# Altium schematic sheet schematics_Lampda_2024-07-19.schdoc
size 425 x 621 mm
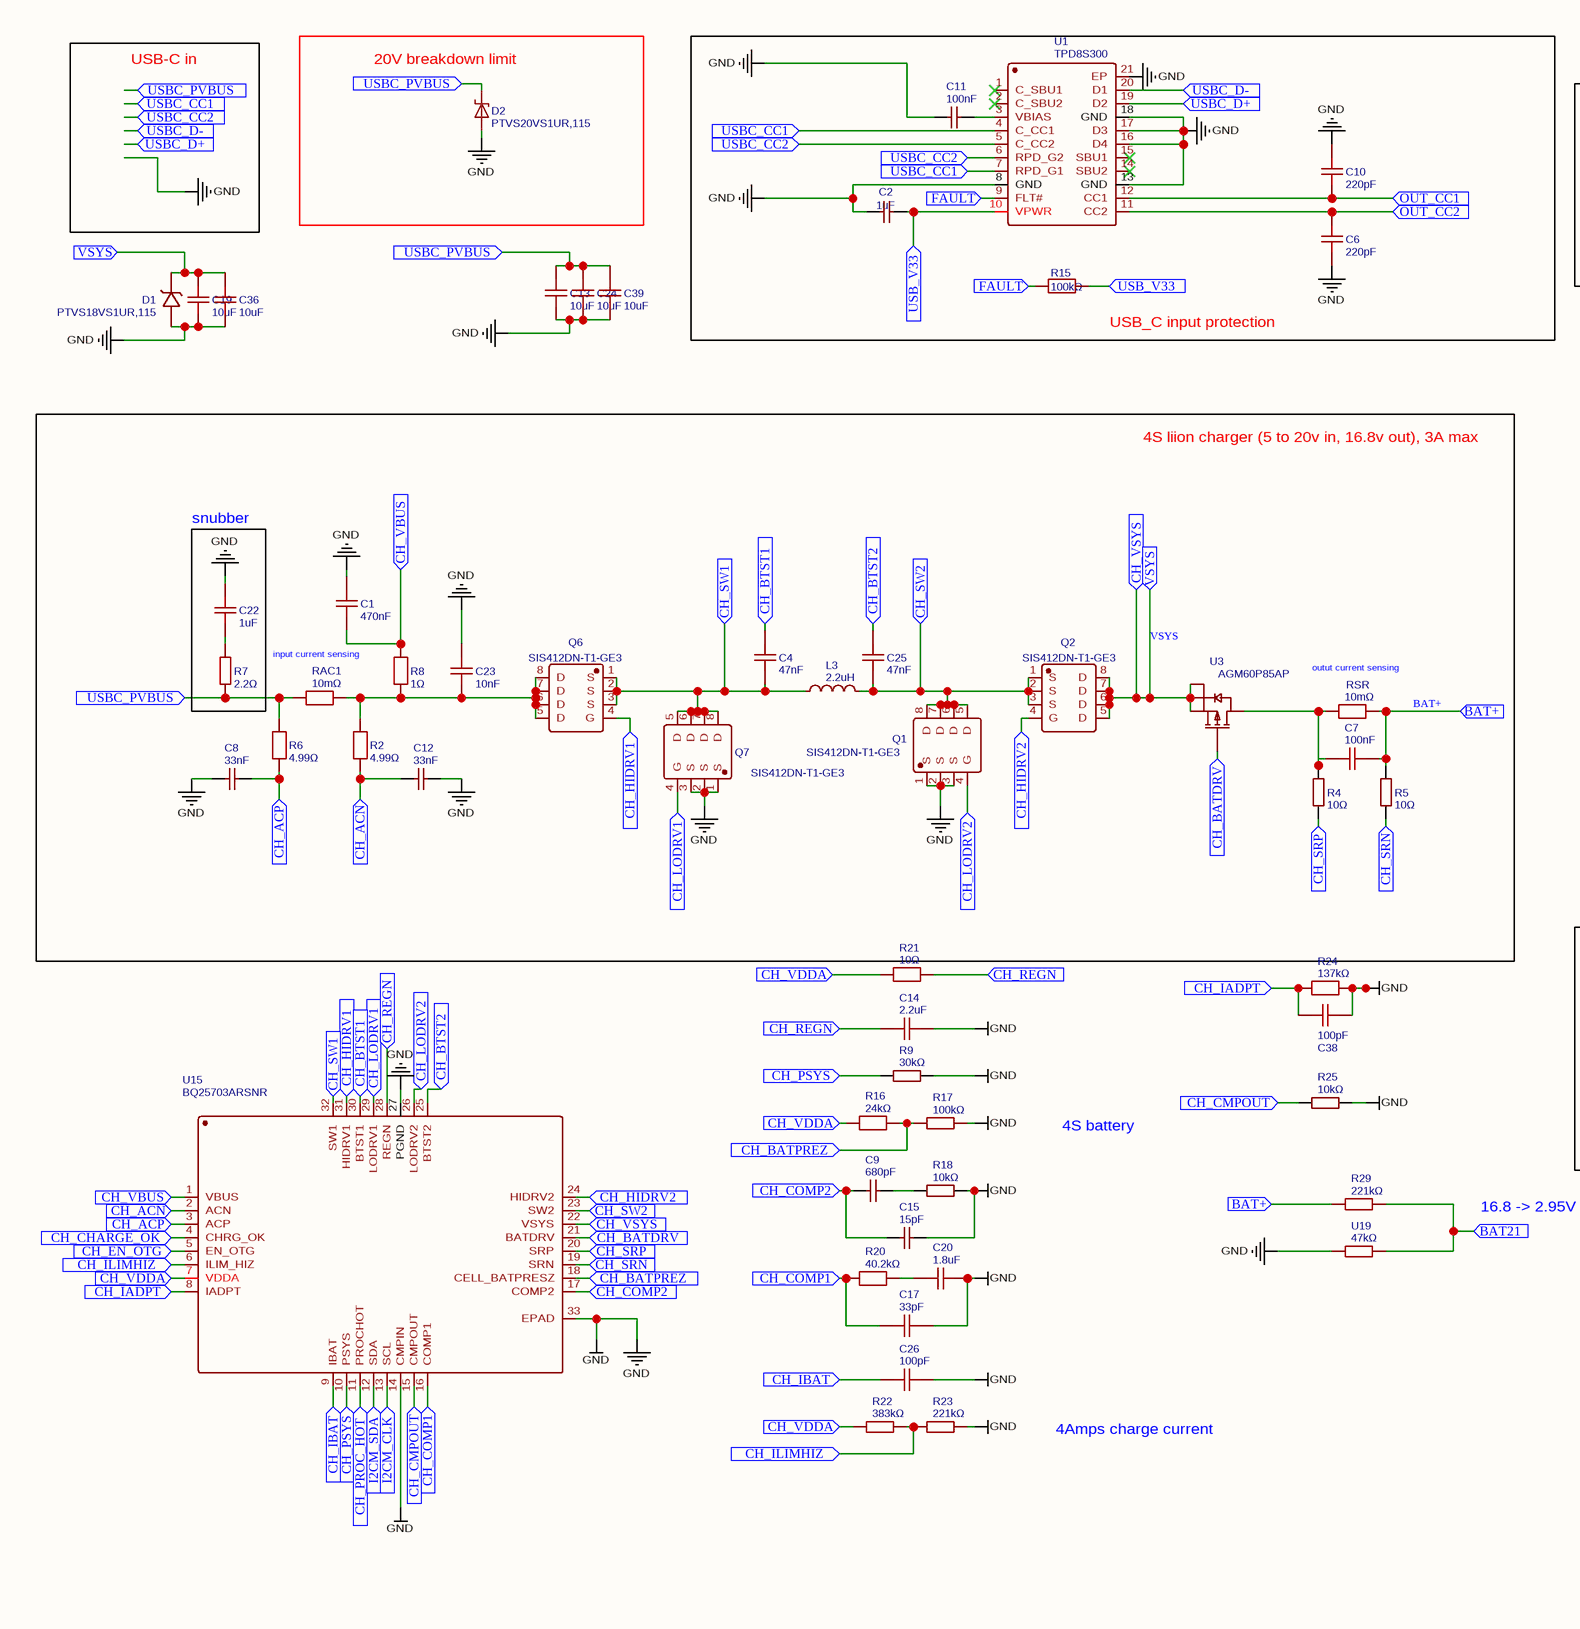
[diagram p0: schematics_Lampda_2024-07-19.schdoc, top left]
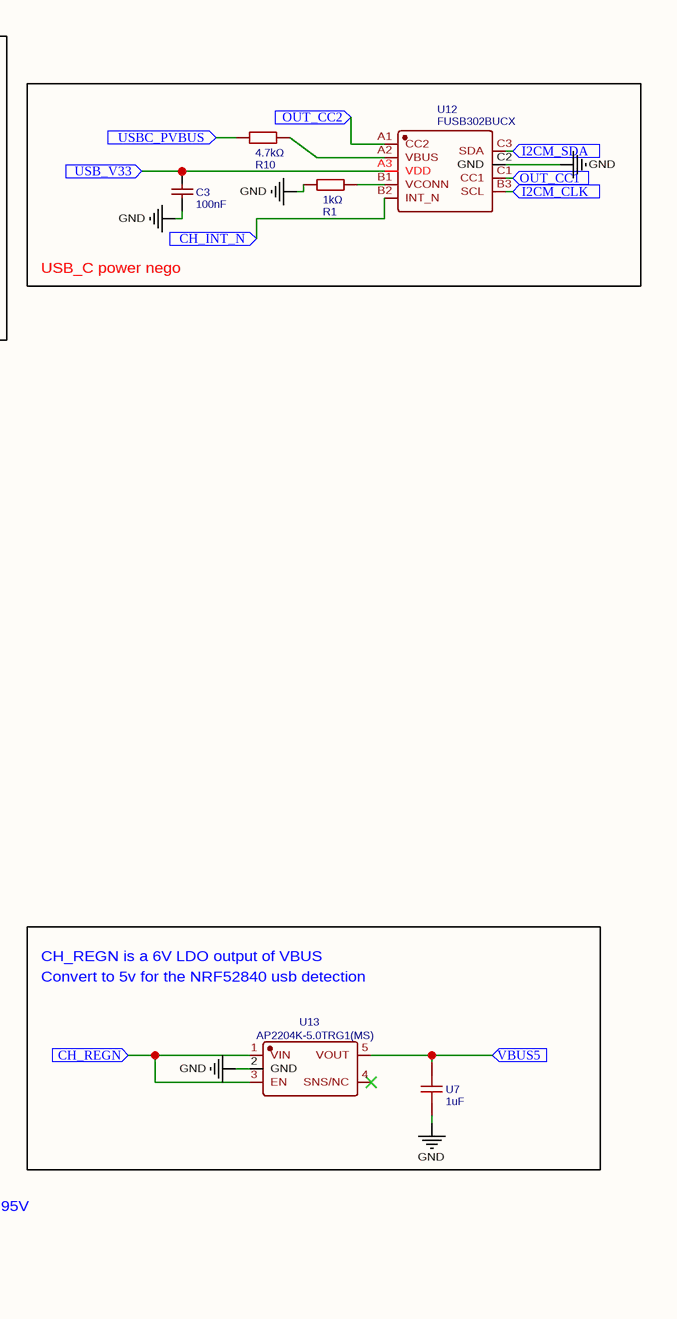
[diagram p1: schematics_Lampda_2024-07-19.schdoc, top right]
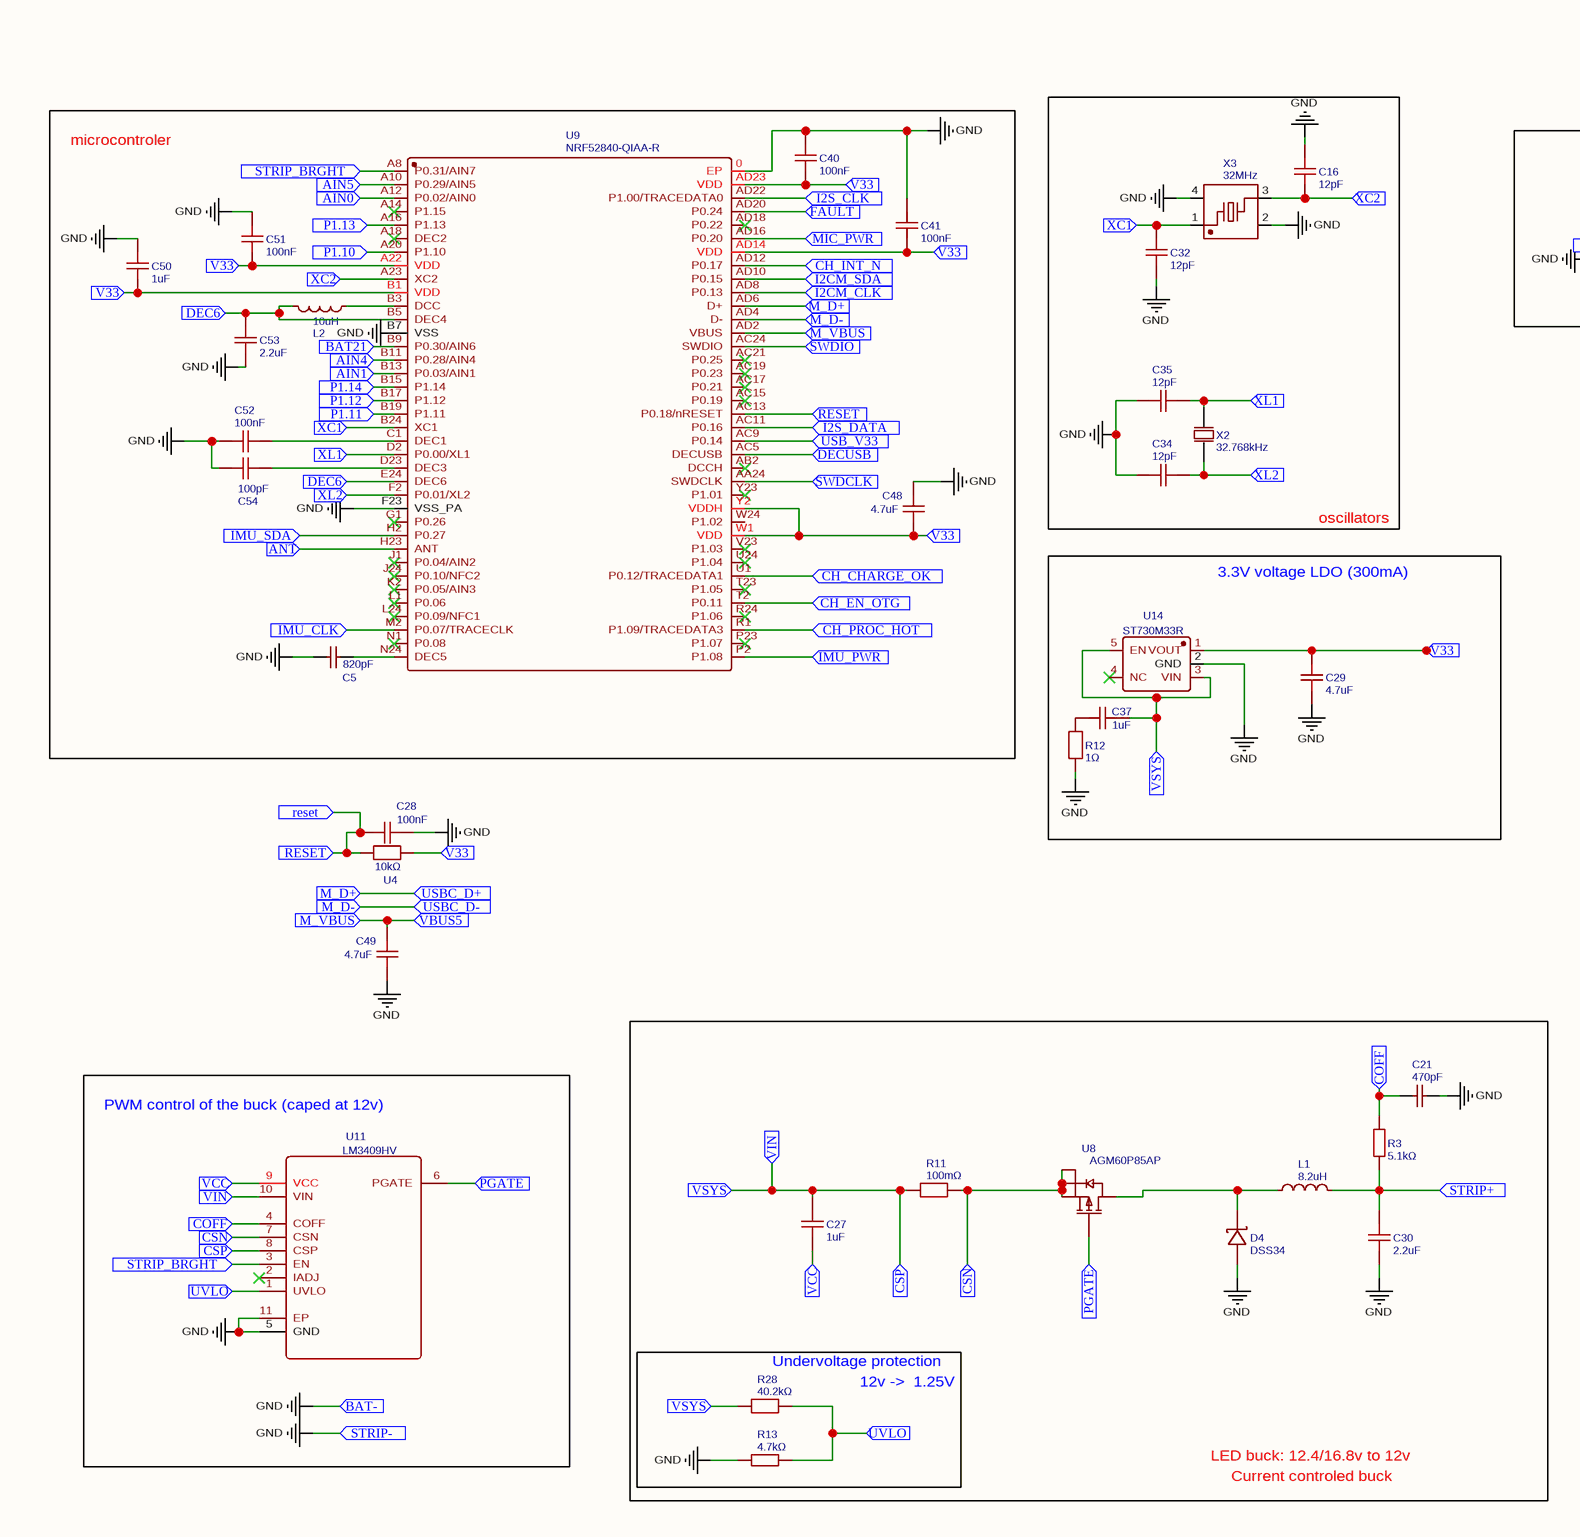
[diagram p2: schematics_Lampda_2024-07-19.schdoc, bottom left]
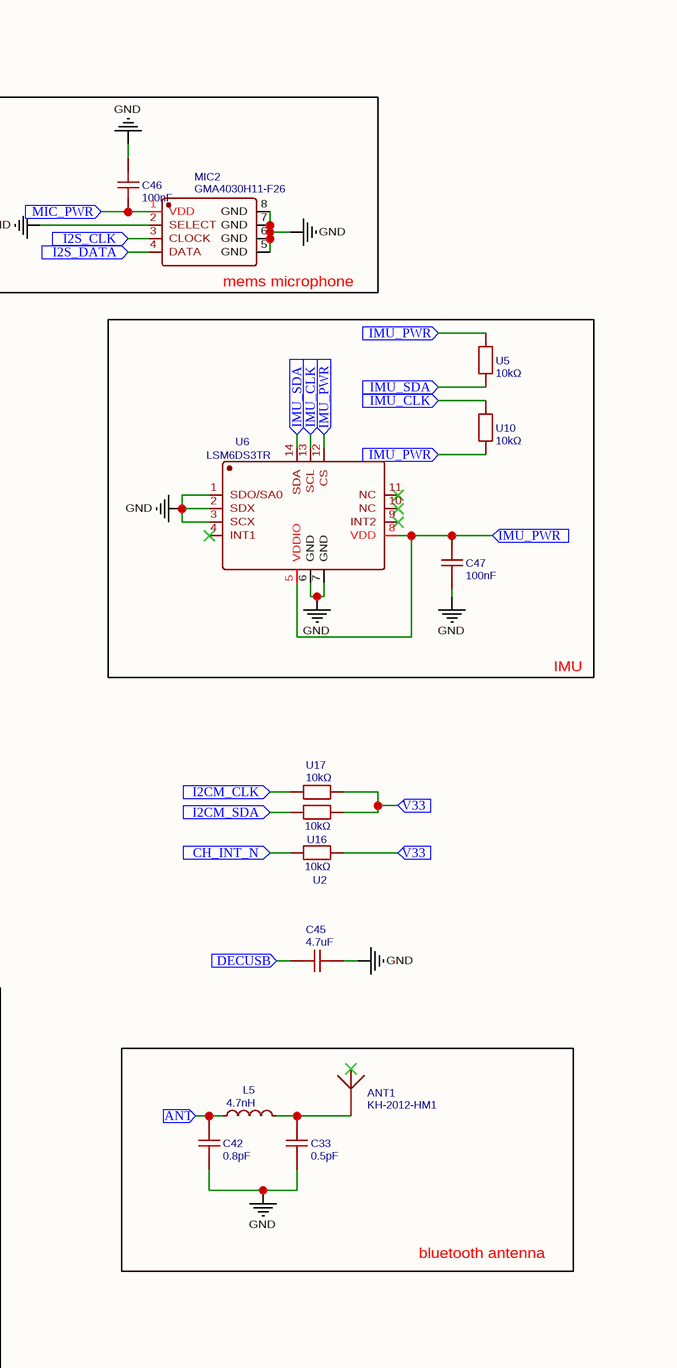
[diagram p3: schematics_Lampda_2024-07-19.schdoc, bottom right]

## Parts
ANT1  KH-2012-HM1  [ANT-SMD_2P-L2.0-W1.2]
C1  470nF  [C0402]
C2  1uF  [C0402]
C3  100nF  [C0402]
C4  47nF  [C0402]
C5  820pF  [C0402]
C6  220pF  [C0402]
C7  100nF  [C0402]
C8  33nF  [C0402]
C9  680pF  [C0402]
C10  220pF  [C0402]
C11  100nF  [C0402]
C12  33nF  [C0402]
C13  10uF  [C0805]
C14  2.2uF  [C0402]
C15  15pF  [C0402]
C16  12pF  [C0402]
C17  33pF  [C0402]
C19  10uF  [C0805]
C20  1.8uF  [C0603]
C21  470pF  [C0402]
C22  1uF  [C0402]
C23  10nF  [C0402]
C24  10uF  [C0805]
C25  47nF  [C0402]
C26  100pF  [C0402]
C27  1uF  [C0402]
C28  100nF  [C0402]
C29  4.7uF  [C0402]
C30  2.2uF  [C0805]
C32  12pF  [C0402]
C33  0.5pF  [C0402]
C34  12pF  [C0402]
C35  12pF  [C0402]
C36  10uF  [C0805]
C37  1uF  [C0402]
C38  100pF  [C0402]
C39  10uF  [C0805]
C40  100nF  [C0402]
C41  100nF  [C0402]
C42  0.8pF  [C0402]
C45  4.7uF  [C0402]
C46  100nF  [C0402]
C47  100nF  [C0402]
C48  4.7uF  [C0402]
C49  4.7uF  [C0402]
C50  1uF  [C0402]
C51  100nF  [C0402]
C52  100nF  [C0402]
C53  2.2uF  [C0402]
C54  100pF  [C0402]
D1  PTVS18VS1UR,115  [SOD-123_L2.6-W1.7-LS3.5-RD]
D2  PTVS20VS1UR,115  [SOD-123_L2.6-W1.7-LS3.5-RD]
D4  DSS34  [SOD-123_L2.8-W1.8-LS3.7-RD]
L1  8.2uH  [IND-SMD_L4.0-W4.0]
L2  10uH  [L0805]
L3  2.2uH  [IND-SMD_L4.8-W4.5]
L5  4.7nH  [L0402]
MIC2  GMA4030H11-F26  [MIC-SMD_8P-L3.0-W4.0-P0.85-BL]
Q1  SIS412DN-T1-GE3  [POWERPAK-1212-8_L3.0-W3.0-P0.65-LS3.3-BL]
Q2  SIS412DN-T1-GE3  [POWERPAK-1212-8_L3.0-W3.0-P0.65-LS3.3-BL]
Q6  SIS412DN-T1-GE3  [POWERPAK-1212-8_L3.0-W3.0-P0.65-LS3.3-BL]
Q7  SIS412DN-T1-GE3  [POWERPAK-1212-8_L3.0-W3.0-P0.65-LS3.3-BL]
R1  1kΩ  [R0402]
R2  4.99Ω  [R0402]
R3  5.1kΩ  [R0402]
R4  10Ω  [R0402]
R5  10Ω  [R0402]
R6  4.99Ω  [R0402]
R7  2.2Ω  [R0805]
R8  1Ω  [R0402]
R9  30kΩ  [R0402]
R10  4.7kΩ  [R0402]
R11  100mΩ  [R1206]
R12  1Ω  [R0402]
R13  4.7kΩ  [R0402]
R15  100kΩ  [R0402]
R16  24kΩ  [R0402]
R17  100kΩ  [R0402]
R18  10kΩ  [R0402]
R20  40.2kΩ  [R0402]
R21  10Ω  [R0402]
R22  383kΩ  [R0402]
R23  221kΩ  [R0402]
R24  137kΩ  [R0402]
R25  10kΩ  [R0402]
R28  40.2kΩ  [R0402]
R29  221kΩ  [R0402]
RAC1  10mΩ  [R1206]
RSR  10mΩ  [R1206]
U1  TPD8S300  [WQFN-20_L3.0-W3.0-P0.40-TL-EP]
U2  10kΩ  [R0402]
U3  AGM60P85AP  [WDFN-5_L3.3-W3.3-P0.65-BL]
U4  10kΩ  [R0402]
U5  10kΩ  [R0402]
U6  LSM6DS3TR  [LGA-14_L3.0-W2.5-P0.50-TL]
U7  1uF  [C0402]
U8  AGM60P85AP  [WDFN-5_L3.3-W3.3-P0.65-BL]
U9  NRF52840-QIAA-R  [AQFN-73_L7.0-W7.0-P0.50-BL-EP4.8]
U10  10kΩ  [R0402]
U11  LM3409HV  [MSOP-10_L3.0-W3.0-P0.50-LS5.0-BL-EP]
U12  FUSB302BUCX  [WLCSP-9_L1.3-W1.2-R3-C3-P0.40-TL]
U13  AP2204K-5.0TRG1(MS)  [SOT-23-5_L3.0-W1.5-P0.95-LS2.8-BL]
U14  ST730M33R  [SOT-23-5_L3.0-W1.6-P0.95-LS2.8-BR]
U15  BQ25703ARSNR  [VQFN-32_L4.0-W4.0-P0.40-TL-EP]
U16  10kΩ  [R0402]
U17  10kΩ  [R0402]
U19  47kΩ  [R0402]
X2  32.768kHz  [CRYSTAL-SMD_L2.0-W1.2]
X3  32MHz  [CRYSTAL-SMD_4P-L2.0-W1.6-BL-A]

## Blocks framed on the sheet
20V breakdown limit: D2
USB_C input protection: C2 C6 C10 C11 R15 U1
USB_C power nego: C3 R1 R10 U12
4S liion charger (5 to 20v in, 16.8v out), 3A max: C1 C4 C7 C8 C12 C23 C25 L3 Q1 Q2 Q6 Q7 R2 R4-R6 R8 RAC1 RSR U3
snubber: C22 R7
microcontroler: C5 C40 C41 C48 C50-C54 L2 U9
oscillators: C16 C32 C34 C35 X2 X3
mems microphone: C46 MIC2
IMU: C47 U5 U6 U10
3.3V voltage LDO (300mA): C29 C37 R12 U14
PWM control of the buck (caped at 12v): U11
bluetooth antenna: ANT1 C33 C42 L5

## Ports
AIN0 (in), AIN1 (in), AIN4 (in), AIN5 (in), ANT (in), BAT21 (in), BAT+ (in), BAT- (in), CH_ACN (in), CH_ACP (in), CH_BATDRV (in), CH_BATPREZ (in), CH_BTST1 (in), CH_BTST2 (in), CH_CHARGE_OK (in), CH_CMPOUT (in), CH_COMP1 (in), CH_COMP2 (in), CH_EN_OTG (in), CH_HIDRV1 (in), CH_HIDRV2 (in), CH_IADPT (in), CH_IBAT (in), CH_ILIMHIZ (in), CH_INT_N (in), CH_LODRV1 (in), CH_LODRV2 (in), CH_PROC_HOT (in), CH_PSYS (in), CH_REGN (in), CH_SRN (in), CH_SRP (in), CH_SW1 (in), CH_SW2 (in), CH_VBUS (in), CH_VDDA (in), CH_VSYS (in), COFF (in), CSN (in), CSP (in), DEC6 (in), DECUSB (in), FAULT (in), I2CM_CLK (in), I2CM_SDA (in), I2S_CLK (in), I2S_DATA (in), IMU_CLK (in), IMU_PWR (in), IMU_SDA (in), M_D+ (in), M_D- (in), M_VBUS (in), MIC_PWR (in), OUT_CC1 (in), OUT_CC2 (in), P1.10 (in), P1.11 (in), P1.12 (in), P1.13 (in), P1.14 (in), PGATE (in), RESET (in), reset (in), STRIP+ (in), STRIP- (in), STRIP_BRGHT (in), SWDCLK (in), SWDIO (in), USB_V33 (in), USBC_CC1 (in), USBC_CC2 (in), USBC_D+ (in), USBC_D- (in), USBC_PVBUS (in), UVLO (in), V33 (in), VBUS5 (in), VCC (in), VIN (in), VSYS (in), XC1 (in), XC2 (in), XL1 (in), XL2 (in)

## Nets
GND: C1.2 C2.1 C3.2 C5.1 C6.2 C8.1 C10.1 C11.1 C12.2 C13.1 C14.2 C15.2 C16.1 C17.2 C19.1 C20.2 C21.2 C22.1 C23.2 C24.1 C26.2 C28.2 C29.1 C30.1 C32.2 C33.2 C34.1 C35.1 C36.1 C38.2 C39.1 C40.2 C41.1 C42.1 C45.1 C46.2 C47.2 C48.2 C49.1 C50.1 C51.2 C52.2 C53.1 C54.1 D1.2 D2.2(A) D4.2(A) MIC2.2(SELECT) MIC2.5(GND) MIC2.6(GND) MIC2.7(GND) MIC2.8(GND) Q1.1(S) Q1.2(S) Q1.3(S) Q7.1(S) Q7.2(S) Q7.3(S) R1.2 R9.2 R12.1 R13.1 R17.2 R18.2 R23.2 R24.2 R25.2 U1.8(GND) U1.13(GND) U1.16(D4) U1.17(D3) U1.18(GND) U1.21(EP) U6.1(SDO/SA0) U6.2(SDX) U6.3(SCX) U6.6(GND) U6.7(GND) U7.1 U9.0(EP) U9.B7(VSS) U9.F23(VSS_PA) U11.5(GND) U11.11(EP) U12.C2(GND) U13.2(GND) U14.2(GND) U15.14(CMPIN) U15.27(PGND) U15.33(EPAD) U19.1 X3.2(GND) X3.4(GND) ; port STRIP-, port BAT-
AIN0: U9.A12(P0.02/AIN0) ; port AIN0
AIN1: U9.B13(P0.03/AIN1) ; port AIN1
AIN4: U9.B11(P0.28/AIN4) ; port AIN4
AIN5: U9.A10(P0.29/AIN5) ; port AIN5
ANT: C42.2 L5.1 U9.H23(ANT) ; port ANT
BAT21: R29.2 U9.B9(P0.30/AIN6) U19.2 ; port BAT21
BAT+: C7.1 R5.2 R29.1 RSR.2 ; port BAT+
CH_ACN: C12.1 R2.1 U15.2(ACN) ; port CH_ACN
CH_ACP: C8.2 R6.1 U15.3(ACP) ; port CH_ACP
CH_BATDRV: U3.4(G) U15.21(BATDRV) ; port CH_BATDRV
CH_BATPREZ: R16.2 R17.1 U15.18(CELL_BATPRESZ) ; port CH_BATPREZ
CH_BTST1: C4.2 U15.30(BTST1) ; port CH_BTST1
CH_BTST2: C25.2 U15.25(BTST2) ; port CH_BTST2
CH_CHARGE_OK: U9.U1(P0.12/TRACEDATA1) U15.4(CHRG_OK) ; port CH_CHARGE_OK
CH_CMPOUT: R25.1 U15.15(CMPOUT) ; port CH_CMPOUT
CH_COMP1: C17.1 R20.1 U15.16(COMP1) ; port CH_COMP1
CH_COMP2: C9.1 C15.1 U15.17(COMP2) ; port CH_COMP2
CH_EN_OTG: U9.T2(P0.11) U15.5(EN_OTG) ; port CH_EN_OTG
CH_HIDRV1: Q6.4(G) U15.31(HIDRV1) ; port CH_HIDRV1
CH_HIDRV2: Q2.4(G) U15.24(HIDRV2) ; port CH_HIDRV2
CH_IADPT: C38.1 R24.1 U15.8(IADPT) ; port CH_IADPT
CH_IBAT: C26.1 U15.9(IBAT) ; port CH_IBAT
CH_ILIMHIZ: R22.2 R23.1 U15.6(ILIM_HIZ) ; port CH_ILIMHIZ
CH_INT_N: U2.1 U9.AD12(P0.17) U12.B2(INT_N) ; port CH_INT_N
CH_LODRV1: Q7.4(G) U15.29(LODRV1) ; port CH_LODRV1
CH_LODRV2: Q1.4(G) U15.26(LODRV2) ; port CH_LODRV2
CH_PROC_HOT: U9.R1(P1.09/TRACEDATA3) U15.11(PROCHOT) ; port CH_PROC_HOT
CH_PSYS: R9.1 U15.10(PSYS) ; port CH_PSYS
CH_REGN: C14.1 R21.2 U13.1(VIN) U13.3(EN) U15.28(REGN) ; port CH_REGN
CH_SRN: R5.1 U15.19(SRN) ; port CH_SRN
CH_SRP: R4.1 U15.20(SRP) ; port CH_SRP
CH_SW1: C4.1 L3.1 Q6.1(S) Q6.2(S) Q6.3(S) Q7.5(D) Q7.6(D) Q7.7(D) Q7.8(D) U15.32(SW1) ; port CH_SW1
CH_SW2: C25.1 L3.2 Q1.5(D) Q1.6(D) Q1.7(D) Q1.8(D) Q2.1(S) Q2.2(S) Q2.3(S) U15.23(SW2) ; port CH_SW2
CH_VBUS: C1.1 R8.2 U15.1(VBUS) ; port CH_VBUS
CH_VDDA: R16.1 R21.1 R22.1 U15.7(VDDA) ; port CH_VDDA
COFF: C21.1 R3.2 U11.4(COFF) ; port COFF
CSN: R11.2 U8.1(S) U8.2(S) U8.3(S) U11.7(CSN) ; port CSN
DEC6: C53.2 L2.1 U9.B5(DEC4) U9.E24(DEC6) ; port DEC6
DECUSB: C45.2 U9.AC5(DECUSB) ; port DECUSB
FAULT: R15.1 U1.9(FLT#) U9.AD20(P0.24) ; port FAULT
I2CM_CLK: U9.AD8(P0.13) U12.B3(SCL) U15.13(SCL) U17.2 ; port I2CM_CLK
I2CM_SDA: U9.AD10(P0.15) U12.C3(SDA) U15.12(SDA) U16.1 ; port I2CM_SDA
I2S_CLK: MIC2.3(CLOCK) U9.AD22(P1.00/TRACEDATA0) ; port I2S_CLK
I2S_DATA: MIC2.4(DATA) U9.AC11(P0.16) ; port I2S_DATA
IMU_CLK: U6.13(SCL) U9.M2(P0.07/TRACECLK) U10.1 ; port IMU_CLK
IMU_PWR: C47.1 U5.1 U6.5(VDDIO) U6.8(VDD) U6.12(CS) U9.P2(P1.08) U10.2 ; port IMU_PWR
IMU_SDA: U5.2 U6.14(SDA) U9.H2(P0.27) ; port IMU_SDA
M_D+: U1.19(D2) U9.AD6(D+) ; port USBC_D+, port M_D+
M_D-: U1.20(D1) U9.AD4(D-) ; port USBC_D-, port M_D-
M_VBUS: C49.2 U7.2 U9.AD2(VBUS) U13.5(VOUT) ; port VBUS5, port M_VBUS
MIC_PWR: C46.1 MIC2.1(VDD) U9.AD16(P0.20) ; port MIC_PWR
OUT_CC1: C10.2 U1.12(CC1) U12.C1(CC1) ; port OUT_CC1
OUT_CC2: C6.1 U1.11(CC2) U12.A1(CC2) ; port OUT_CC2
P1.10: U9.A20(P1.10) ; port P1.10
P1.11: U9.B19(P1.11) ; port P1.11
P1.12: U9.B17(P1.12) ; port P1.12
P1.13: U9.A16(P1.13) ; port P1.13
P1.14: U9.B15(P1.14) ; port P1.14
PGATE: U8.4(G) U11.6(PGATE) ; port PGATE
RESET: C28.1 U4.1 U9.AC13(P0.18/nRESET) ; port RESET, port reset
STRIP+: C30.2 L1.2 R3.1 ; port STRIP+
STRIP_BRGHT: U9.A8(P0.31/AIN7) U11.3(EN) ; port STRIP_BRGHT
SWDCLK: U9.AA24(SWDCLK) ; port SWDCLK
SWDIO: U9.AC24(SWDIO) ; port SWDIO
USB_V33: C2.2 C3.1 R15.2 U1.10(VPWR) U9.AC9(P0.14) U12.A3(VDD) ; port USB_V33
USBC_CC1: U1.4(C_CC1) U1.7(RPD_G1) ; port USBC_CC1
USBC_CC2: U1.5(C_CC2) U1.6(RPD_G2) ; port USBC_CC2
USBC_PVBUS: C13.2 C24.2 C39.2 D2.1(C) R6.2 R7.1 R10.1 RAC1.1 ; port USBC_PVBUS
UVLO: R13.2 R28.2 U11.1(UVLO) ; port UVLO
V33: C29.2 C40.1 C41.2 C48.1 C50.2 C51.1 U2.2 U4.2 U9.A22(VDD) U9.AD14(VDD) U9.AD23(VDD) U9.B1(VDD) U9.W1(VDD) U9.Y2(VDDH) U14.1(VOUT) U16.2 U17.1 ; port V33
VCC: C27.1 U11.9(VCC) ; port VCC
VSYS: C19.2 C27.2 C36.2 C37.2 D1.1 Q2.5(D) Q2.6(D) Q2.7(D) Q2.8(D) R11.1 R28.1 U3.1(S) U3.2(S) U3.3(S) U11.8(CSP) U11.10(VIN) U14.3(VIN) U14.5(EN) U15.22(VSYS) ; port VSYS, port CSP, port VIN, port CH_VSYS
XC1: C32.1 U9.B24(XC1) X3.1 ; port XC1
XC2: C16.2 U9.A23(XC2) X3.3 ; port XC2
XL1: C35.2 U9.D2(P0.00/XL1) X2.2(OSC2) ; port XL1
XL2: C34.2 U9.F2(P0.01/XL2) X2.1(OSC1) ; port XL2
NetANT1_1: ANT1.1(ANT) C33.1 L5.2
NetC5_2: C5.2 U9.N24(DEC5)
NetC7_2: C7.2 R4.2 RSR.1 U3.5(D)
NetC9_2: C9.2 R18.1
NetC11_2: C11.2 U1.3(VBIAS)
NetC20_1: C20.1 R20.2
NetC22_2: C22.2 R7.2
NetC23_1: C23.1 Q6.5(D) Q6.6(D) Q6.7(D) Q6.8(D) R2.2 R8.1 RAC1.2
NetC37_1: C37.1 R12.2
NetC52_1: C52.1 U9.C1(DEC1)
NetC54_2: C54.2 U9.D23(DEC3)
NetD4_1: D4.1(K) L1.1 U8.5(D)
NetL2_2: L2.2 U9.B3(DCC)
NetR1_1: R1.1 U12.B1(VCONN)
NetR10_2: R10.2 U12.A2(VBUS)

Not connected (* = marked no-connect by the designer): ANT1 2*; U1 1(C_SBU1)* 2(C_SBU2)* 14(SBU2)* 15(SBU1)*; U6 4(INT1)* 9(INT2)* 10(NC)* 11(NC)*; U9 A14(P1.15)* A18(DEC2)* AB2(DCCH)* AC15(P0.19)* AC17(P0.21)* AC19(P0.23)* AC21(P0.25)* AD18(P0.22)* G1(P0.26)* J1(P0.04/AIN2)* J24(P0.10/NFC2)* K2(P0.05/AIN3)* L1(P0.06)* L24(P0.09/NFC1)* N1(P0.08)* P23(P1.07)* R24(P1.06)* T23(P1.05)* U24(P1.04)* V23(P1.03)* W24(P1.02) Y23(P1.01)*; U11 2(IADJ)*; U13 4(SNS/NC)*; U14 4(NC)*

## Notes on the sheet
- USB-C in
- input current sensing
- (near RSR) outut current sensing
- CH_REGN is a 6V LDO output of VBUS
- Convert to 5v for the NRF52840 usb detection
- 4S battery
- 16.8 -> 2.95V
- 4Amps charge current
- (near R28) Undervoltage protection
- 12v ->  1.25V
- LED buck: 12.4/16.8v to 12v
- Current controled buck

## Library data of the parts
ANT1 = KH-2012-HM1: Manufacturer: kinghelm(金航标); Contributor: lcsc; Supplier: LCSC; Supplier Part: C2925419; Manufacturer Part: KH-2012-HM1; spicePre: A; spiceSymbolName: KH-2012-HM1
C1 = 470nF: Manufacturer: YAGEO(国巨); Manufacturer Part: CC0402KRX5R9BB474; nameAlias: Value; Contributor: LCSC; Supplier: LCSC; Supplier Part: C513552; JLCPCB Part Class: Extended Part; spicePre: C; spiceSymbolName: CC0402KRX5R9BB474
C2 = 1uF: Manufacturer Part: CL05A105KP5NNNC; Manufacturer: SAMSUNG(三星); nameAlias: Value; Supplier: LCSC; Supplier Part: C14445; JLCPCB Part Class: Extended Part; spicePre: C; spiceSymbolName: CL05A105KP5NNNC
C3 C11 = 100nF: Manufacturer: YAGEO(国巨); Manufacturer Part: CC0402KRX7R9BB104; nameAlias: Value; Contributor: LCSC; Supplier: LCSC; Supplier Part: C131394; JLCPCB Part Class: Extended Part; spicePre: C; spiceSymbolName: CC0402KRX7R9BB104
C4 C25 = 47nF: Manufacturer: CCTC(三环); Manufacturer Part: TCC0402X7R473K500AT; nameAlias: Value; Contributor: lcsc; Supplier: LCSC; Supplier Part: C880605; JLCPCB Part Class: Extended Part; spicePre: C; spiceSymbolName: TCC0402X7R473K500AT
C5 = 820pF: Manufacturer: FH(风华); Manufacturer Part: 0402B821K500NT; nameAlias: Value; Supplier: LCSC; Supplier Part: C1543; JLCPCB Part Class: Extended Part; spicePre: C; spiceSymbolName: 0402B821K500NT
C6 C10 = 220pF: Manufacturer: CCTC(三环); Manufacturer Part: TCC0402X7R221K500AT; nameAlias: Value; Contributor: LCSC; Supplier: LCSC; Supplier Part: C466236; JLCPCB Part Class: Extended Part; spicePre: C; spiceSymbolName: TCC0402X7R221K500AT
C7 = 100nF: Manufacturer: Walsin(华新科); Manufacturer Part: 0402B104K250CT; nameAlias: Value; Contributor: LCSC; Supplier: LCSC; Supplier Part: C301930; JLCPCB Part Class: Extended Part; spicePre: C; spiceSymbolName: 0402B104K250CT
C8 C12 = 33nF: Manufacturer: YAGEO(国巨); Manufacturer Part: CC0402KRX7R9BB333; nameAlias: Value; Supplier: LCSC; Supplier Part: C106862; JLCPCB Part Class: Extended Part; spicePre: C; spiceSymbolName: CC0402KRX7R9BB333
C9 = 680pF: Manufacturer: FH(风华); Manufacturer Part: 0402B681K500NT; nameAlias: Value; Supplier: LCSC; Supplier Part: C1541; spicePre: C; spiceSymbolName: 0402B681K500NT
C13 C19 C24 C36 C39 = 10uF: Manufacturer: muRata(村田); Manufacturer Part: GRT21BC71E106KE13L; nameAlias: Value; Contributor: lcsc; Supplier: LCSC; Supplier Part: C882505; JLCPCB Part Class: Extended Part; spicePre: C; spiceSymbolName: GRT21BC71E106KE13L
C14 = 2.2uF: Manufacturer: FH(风华); Manufacturer Part: 0402X225K100NT; nameAlias: Value; Contributor: LCSC; Supplier: LCSC; Supplier Part: C501835; JLCPCB Part Class: Extended Part; spicePre: C; spiceSymbolName: 0402X225K100NT
C15 = 15pF: Manufacturer: FH(风华); Manufacturer Part: 0402CG150J500NT; nameAlias: Value; Supplier: LCSC; Supplier Part: C1548; JLCPCB Part Class: Basic Part; spicePre: C; spiceSymbolName: 0402CG150J500NT
C16 C32 C34 C35 = 12pF: Manufacturer: FH(风华); Manufacturer Part: 0402CG120F500NT; nameAlias: Value; Contributor: LCSC; Supplier: LCSC; Supplier Part: C182477; JLCPCB Part Class: Extended Part; spicePre: C; spiceSymbolName: 0402CG120F500NT
C17 = 33pF: Manufacturer: Chinocera(华瓷); Manufacturer Part: HGC0402G0330J500NTEJ; nameAlias: Value; Contributor: LCSC; Supplier: LCSC; Supplier Part: C482484; JLCPCB Part Class: Extended Part; spicePre: C; spiceSymbolName: HGC0402G0330J500NTEJ
C20 = 1.8uF: Manufacturer: CCTC(三环); Manufacturer Part: TCC0603X5R185K160CT; nameAlias: Value; Contributor: lcsc; Supplier: LCSC; Supplier Part: C7393894; JLCPCB Part Class: Extended Part; spicePre: C; spiceSymbolName: TCC0603X5R185K160CT
C21 = 470pF: Manufacturer Part: CL05B471KB5NNNC; Manufacturer: SAMSUNG(三星); nameAlias: Value; Supplier: LCSC; Supplier Part: C26412; JLCPCB Part Class: Extended Part; spicePre: C; spiceSymbolName: CL05B471KB5NNNC
C22 C37 = 1uF: Manufacturer: SAMSUNG(三星); Manufacturer Part: CL05A105KL5NRNC; nameAlias: Value; Contributor: LCSC; Supplier: LCSC; Supplier Part: C307413; JLCPCB Part Class: Extended Part; spicePre: C; spiceSymbolName: CL05A105KL5NRNC
C23 = 10nF: Manufacturer: YAGEO(国巨); Manufacturer Part: CC0402JRX7R9BB103; nameAlias: Value; Contributor: LCSC; JLCPCB Part Class: Extended Part; Supplier: LCSC; Supplier Part: C272878; spicePre: C; spiceSymbolName: CC0402JRX7R9BB103
C26 C38 = 100pF: Manufacturer: YAGEO(国巨); Manufacturer Part: CC0402JRX7R9BB101; nameAlias: Value; Contributor: LCSC; Supplier: LCSC; Supplier Part: C281750; JLCPCB Part Class: Extended Part; spicePre: C; spiceSymbolName: CC0402JRX7R9BB101
C27 = 1uF: Manufacturer: SANYEAR(叁叶源); Manufacturer Part: C0402X5R105K250NT; nameAlias: Value; Contributor: LCSC; Supplier: LCSC; Supplier Part: C466612; JLCPCB Part Class: Extended Part; spicePre: C; spiceSymbolName: C0402X5R105K250NT
C28 C40 C41 C51 C52 = 100nF: Manufacturer: Walsin(华新科); Manufacturer Part: 0402B104K160CT; nameAlias: Value; Supplier: LCSC; Supplier Part: C83056; JLCPCB Part Class: Extended Part; spicePre: C; spiceSymbolName: 0402B104K160
C29 C45 C48 C49 = 4.7uF: Manufacturer: FH(风华); Manufacturer Part: 0402X475K100NT; nameAlias: Value; Contributor: LCSC; Supplier: LCSC; Supplier Part: C191541; JLCPCB Part Class: Extended Part; spicePre: C; spiceSymbolName: 0402X475K100NT
C30 = 2.2uF: Manufacturer: CCTC(三环); Manufacturer Part: TCC0805X5R225K250FT; nameAlias: Value; Contributor: lcsc; Supplier: LCSC; Supplier Part: C2903666; JLCPCB Part Class: Extended Part; spicePre: C; spiceSymbolName: TCC0805X5R225K250FT
C33 = 0.5pF: Manufacturer: YAGEO(国巨); Manufacturer Part: CC0402CRNPO9BNR50; nameAlias: Value; Contributor: LCSC; Supplier: LCSC; Supplier Part: C327230; JLCPCB Part Class: Extended Part; spicePre: C; spiceSymbolName: CC0402CRNPO9BNR50
C42 = 0.8pF: Manufacturer: EYANG(宇阳科技); Manufacturer Part: C0402C0G0R8C500NTB; nameAlias: Value; Contributor: LCSC; Supplier: LCSC; Supplier Part: C115605; JLCPCB Part Class: Extended Part; spicePre: C; spiceSymbolName: C0402C0G0R8C500NTB
C46 C47 = 100nF: Manufacturer: CCTC(三环); Manufacturer Part: TCC0402X5R104K250AT; nameAlias: Value; Contributor: lcsc; Supplier: LCSC; Supplier Part: C880603; JLCPCB Part Class: Extended Part; spicePre: C; spiceSymbolName: TCC0402X5R104K250AT
C50 = 1uF: Manufacturer: Walsin(华新科); Manufacturer Part: 0402X105K100CT; nameAlias: Value; Contributor: LCSC; Supplier: LCSC; Supplier Part: C164868; JLCPCB Part Class: Extended Part; spicePre: C; spiceSymbolName: 0402X105K100
C53 = 2.2uF: Manufacturer: KEMET(基美); Manufacturer Part: C0402C225M9PACTU; nameAlias: Value; Contributor: LCSC; Supplier: LCSC; Supplier Part: C452745; JLCPCB Part Class: Extended Part; spicePre: C; spiceSymbolName: C0402C225M9PACTU
C54 = 100pF: Manufacturer: CCTC(三环); Manufacturer Part: TCC0402COG101K500AT; nameAlias: Value; Contributor: LCSC; Supplier: LCSC; Supplier Part: C696853; JLCPCB Part Class: Extended Part; spicePre: C; spiceSymbolName: TCC0402COG101K500AT
D1 = PTVS18VS1UR,115: Manufacturer: Nexperia(安世); Contributor: LCSC; Supplier: LCSC; Supplier Part: C553384; Manufacturer Part: PTVS18VS1UR,115; JLCPCB Part Class: Extended Part; spicePre: D; spiceSymbolName: PTVS18VS1UR,115
D2 = PTVS20VS1UR,115: Manufacturer: Nexperia(安世); Contributor: LCSC; Supplier: LCSC; Supplier Part: C461164; Manufacturer Part: PTVS20VS1UR,115; JLCPCB Part Class: Extended Part; spicePre: D; spiceSymbolName: PTVS20VS1UR,115
D4 = DSS34: Manufacturer: 星海; Supplier: LCSC; Manufacturer Part: DSS34; Supplier Part: C84632; JLCPCB Part Class: Extended Part; spicePre: D; spiceSymbolName: DSS34
L1 = 8.2uH: Manufacturer: cjiang(长江微电); Manufacturer Part: FHD4020S-8R2MT; nameAlias: Value; Contributor: LCSC; Supplier: LCSC; Supplier Part: C843302; JLCPCB Part Class: Extended Part; spicePre: L; spiceSymbolName: FHD4020S-8R2MT
L2 = 10uH: Manufacturer: Yanchuang(研创); Manufacturer Part: SCMI201209X100KT; nameAlias: Value; Contributor: LCSC; Supplier: LCSC; Supplier Part: C479906; JLCPCB Part Class: Extended Part; spicePre: L; spiceSymbolName: SCMI201209X100KT
L3 = 2.2uH: Manufacturer: SXN(顺翔诺); Manufacturer Part: SMMS0420-2R2M; nameAlias: Value; Contributor: LCSC; Supplier: LCSC; Supplier Part: C133191; JLCPCB Part Class: Extended Part; spicePre: L; spiceSymbolName: SMMS0420-2R2M
L5 = 4.7nH: Manufacturer: chilisin(奇力新); Manufacturer Part: CLH1005T-4N7S-S-NP; nameAlias: Value; Supplier: LCSC; Supplier Part: C142221; JLCPCB Part Class: Extended Part; spicePre: L; spiceSymbolName: CLH1005T-4N7S-S-NP
MIC2 = GMA4030H11-F26: Manufacturer: INGHAi(赢海); Contributor: LCSC; Supplier: LCSC; Supplier Part: C498193; Manufacturer Part: GMA4030H11-F26; JLCPCB Part Class: Extended Part; spicePre: M; spiceSymbolName: GMA4030H11-F26
Q1 Q2 Q6 Q7 = SIS412DN-T1-GE3: Manufacturer: VISHAY(威世); Supplier: LCSC; Manufacturer Part: SIS412DN-T1-GE3; Supplier Part: C111309; JLCPCB Part Class: Extended Part; spicePre: Q; spiceSymbolName: SIS412DN-T1-GE3
R1 = 1kΩ: Manufacturer: EVER OHMS(天二科技); Manufacturer Part: QR0402F1K00Q10Z; nameAlias: Value; Contributor: LCSC; Supplier: LCSC; Supplier Part: C176101; JLCPCB Part Class: Extended Part; spicePre: R; spiceSymbolName: QR0402F1KQ10
R2 R6 = 4.99Ω: Manufacturer: VISHAY(威世); Manufacturer Part: CRCW04024R99FKED; nameAlias: Value; Contributor: lcsc; Supplier: LCSC; Supplier Part: C844114; JLCPCB Part Class: Extended Part; spicePre: R; spiceSymbolName: CRCW04024R99FKED
R3 = 5.1kΩ: Manufacturer: Tyohm(幸亚电阻); Manufacturer Part: RMC04025.1K5%N; nameAlias: Value; Contributor: LCSC; Supplier: LCSC; Supplier Part: C325524; JLCPCB Part Class: Extended Part; spicePre: R; spiceSymbolName: RMC04025.1K5%N
R4 R5 = 10Ω: Manufacturer: UNI-ROYAL(厚声); Manufacturer Part: 0402WGF100JTCE; nameAlias: Value; Supplier: LCSC; Supplier Part: C25077; JLCPCB Part Class: Basic Part; spicePre: R; spiceSymbolName: 0402WGF100JTCE
R7 = 2.2Ω: Manufacturer: Tyohm(幸亚电阻); Manufacturer Part: RMC08052.25%N; nameAlias: Value; Contributor: LCSC; Supplier: LCSC; Supplier Part: C325837; JLCPCB Part Class: Extended Part; spicePre: R; spiceSymbolName: RMC08052.25%N
R8 R12 = 1Ω: Manufacturer: EVER OHMS(天二科技); Manufacturer Part: CR0402F1R00Q10Z; Contributor: LCSC; nameAlias: Value; Supplier: LCSC; Supplier Part: C881121; JLCPCB Part Class: Extended Part; spicePre: R; spiceSymbolName: CR0402F1R00Q10Z
R9 = 30kΩ: Manufacturer: UNI-ROYAL(厚声); Manufacturer Part: 0402WGF3002TCE; nameAlias: Value; Supplier: LCSC; Supplier Part: C25776; JLCPCB Part Class: Extended Part; spicePre: R; spiceSymbolName: 0402WGF3002TCE
R10 = 4.7kΩ: Manufacturer: Tyohm(幸亚电阻); Manufacturer Part: RMC04024K7JN; nameAlias: Value; Contributor: LCSC; Supplier: LCSC; Supplier Part: C269679; JLCPCB Part Class: Extended Part; spicePre: R; spiceSymbolName: RMC04024.7K5%N
R11 = 100mΩ: Manufacturer: Milliohm(毫欧); Manufacturer Part: HoRF1206-1/4W-100mR-1%; nameAlias: Value; Contributor: lcsc; Supplier: LCSC; Supplier Part: C2912704; JLCPCB Part Class: Extended Part; spicePre: R; spiceSymbolName: HORF1206-1/4W-100MR-1%
R13 = 4.7kΩ: Manufacturer: Tyohm(幸亚电阻); Manufacturer Part: RMC04024K7FN; nameAlias: Value; Contributor: LCSC; Supplier: LCSC; Supplier Part: C270129; JLCPCB Part Class: Extended Part; spicePre: R; spiceSymbolName: RMC04024.7K1%N
R15 = 100kΩ: Manufacturer: RALEC(旺诠); Manufacturer Part: RAT021003FTH; nameAlias: Value; Contributor: lcsc; Supplier: LCSC; Supplier Part: C5139597; JLCPCB Part Class: Extended Part; spicePre: R; spiceSymbolName: RAT021003FTH
R16 = 24kΩ: Manufacturer: UNI-ROYAL(厚声); Manufacturer Part: 0402WGD2402TCE; nameAlias: Value; Contributor: LCSC; Supplier: LCSC; Supplier Part: C407741; JLCPCB Part Class: Extended Part; spicePre: R; spiceSymbolName: 0402WGD2402TCE
R17 = 100kΩ: Manufacturer: UNI-ROYAL(厚声); Manufacturer Part: 0402WGD1003TCE; nameAlias: Value; Contributor: LCSC; Supplier: LCSC; Supplier Part: C270658; JLCPCB Part Class: Extended Part; spicePre: R; spiceSymbolName: 0402WGD1003TCE
R18 R25 = 10kΩ: Manufacturer: UNI-ROYAL(厚声); Manufacturer Part: 0402WGF1002TCE; nameAlias: Value; Supplier: LCSC; Supplier Part: C25744; spicePre: R; spiceSymbolName: 0402WGF1002TCE
R20 R28 = 40.2kΩ: Manufacturer: EVER OHMS(天二科技); Manufacturer Part: CR0402F40K2Q10Z; Contributor: LCSC; nameAlias: Value; Supplier: LCSC; Supplier Part: C881147; JLCPCB Part Class: Extended Part; spicePre: R; spiceSymbolName: CR0402F40K2Q10Z
R21 = 10Ω: Manufacturer: EVER OHMS(天二科技); Manufacturer Part: CR0402F10R0Q10Z; Contributor: LCSC; nameAlias: Value; Supplier: LCSC; Supplier Part: C881180; JLCPCB Part Class: Extended Part; spicePre: R; spiceSymbolName: CR0402F10R0Q10Z
R22 = 383kΩ: Manufacturer: Walsin(华新科); Manufacturer Part: WR04X3833FTL; nameAlias: Value; Contributor: LCSC; Supplier: LCSC; Supplier Part: C172061; JLCPCB Part Class: Extended Part; spicePre: R; spiceSymbolName: WR04X3833FTL
R23 R29 = 221kΩ: Manufacturer: YAGEO(国巨); Manufacturer Part: RC0402FR-07221KL; nameAlias: Value; Contributor: LCSC; Supplier: LCSC; Supplier Part: C163479; JLCPCB Part Class: Extended Part; spicePre: R; spiceSymbolName: RC0402FR-07221KL
R24 = 137kΩ: Manufacturer: UNI-ROYAL(厚声); Manufacturer Part: TC0250D1373TCE; Contributor: lcsc; nameAlias: Value; Supplier: LCSC; Supplier Part: C778430; JLCPCB Part Class: Extended Part; spicePre: R; spiceSymbolName: TC0250D1373TCE
RAC1 RSR = 10mΩ: Manufacturer: Milliohm(毫欧); Manufacturer Part: HoJLR1206-1W-10mR-1%; nameAlias: Value; Contributor: LCSC; Supplier: LCSC; Supplier Part: C2903499; JLCPCB Part Class: Extended Part; spicePre: R; spiceSymbolName: HOJLR1206-1W-10MR-1%
U1 = TPD8S300: Manufacturer: TI(德州仪器); Manufacturer Part: TPD8S300RUKR; Contributor: LCSC; Supplier: LCSC; Supplier Part: C571205; JLCPCB Part Class: Extended Part; spicePre: U; spiceSymbolName: TPD8S300RUKR
U2 U4 U5 U10 U16 U17 = 10kΩ: Manufacturer: RALEC(旺诠); Manufacturer Part: RAT021002FTH; Contributor: lcsc; nameAlias: Value; Supplier: LCSC; Supplier Part: C5119777; JLCPCB Part Class: Extended Part; spicePre: U; spiceSymbolName: RAT021002FTH
U3 U8 = AGM60P85AP: Manufacturer: AGM-Semi(芯控源); Contributor: lcsc; Supplier: LCSC; Supplier Part: C17701049; Manufacturer Part: AGM60P85AP; JLCPCB Part Class: Extended Part; spicePre: U; spiceSymbolName: AGM60P85AP
U6 = LSM6DS3TR: Manufacturer: ST(意法半导体); Contributor: LCSC; Supplier: LCSC; Supplier Part: C95230; Manufacturer Part: LSM6DS3TR; JLCPCB Part Class: Extended Part; spicePre: U; spiceSymbolName: LSM6DS3TR
U7 = 1uF: Manufacturer: Chinocera(华瓷); Manufacturer Part: HGC0402R5105K250NTEJ; nameAlias: Value; Contributor: lcsc; Supplier: LCSC; Supplier Part: C7472946; JLCPCB Part Class: Extended Part; spicePre: U; spiceSymbolName: HGC0402R5105K250NTEJ
U9 = NRF52840-QIAA-R: Manufacturer: NORDIC; Contributor: LCSC; nameAlias: Value; Supplier: LCSC; Supplier Part: C190794; Manufacturer Part: NRF52840-QIAA-R; JLCPCB Part Class: Extended Part; spicePre: U; spiceSymbolName: NRF52840-QIAA-R
U11 = LM3409HV: Manufacturer: TI(德州仪器); Manufacturer Part: LM3409HVMY/NOPB; nameAlias: Value; Supplier: LCSC; Supplier Part: C11157; JLCPCB Part Class: Extended Part; spicePre: U; spiceSymbolName: LM3409HVMY/NOPB
U12 = FUSB302BUCX: Manufacturer: onsemi(安森美); Contributor: LCSC; Supplier: LCSC; Supplier Part: C891307; Manufacturer Part: FUSB302BUCX; JLCPCB Part Class: Extended Part; spicePre: U; spiceSymbolName: FUSB302BUCX
U13 = AP2204K-5.0TRG1(MS): Manufacturer: MSKSEMI(美森科); Contributor: lcsc; Supplier: LCSC; Supplier Part: C20627186; Manufacturer Part: AP2204K-5.0TRG1(MS); JLCPCB Part Class: Extended Part; spicePre: U; spiceSymbolName: AP2204K-5.0TRG1(MS)
U14 = ST730M33R: Manufacturer: ST(意法半导体); Contributor: lcsc; Supplier: LCSC; Supplier Part: C2846046; Manufacturer Part: ST730M33R; JLCPCB Part Class: Extended Part; spicePre: U; spiceSymbolName: ST730M33R
U15 = BQ25703ARSNR: Manufacturer: TI(德州仪器); Contributor: LCSC; Supplier: LCSC; Supplier Part: C188229; Manufacturer Part: BQ25703ARSNR; JLCPCB Part Class: Extended Part; spicePre: U; spiceSymbolName: BQ25703ARSNR
U19 = 47kΩ: Manufacturer: RESI(开步睿思）; Manufacturer Part: HPCR0402F47K0K9; Contributor: LCSC; nameAlias: Value; Supplier: LCSC; Supplier Part: C365018; JLCPCB Part Class: Extended Part; spicePre: U; spiceSymbolName: HPCR0402F47K0K9
X2 = 32.768kHz: Manufacturer: ABRACON; Manufacturer Part: ABS06-32.768KHZ-6-1-T; nameAlias: Value; Contributor: lcsc; Supplier: LCSC; Supplier Part: C3015107; JLCPCB Part Class: Extended Part; spicePre: X; spiceSymbolName: ABS06-32.768KHZ-6-1-T
X3 = 32MHz: Manufacturer: SCTF(星通时频); Manufacturer Part: SX1B32.000F1210F30; Contributor: lcsc; nameAlias: Value; Supplier: LCSC; Supplier Part: C2901739; JLCPCB Part Class: Extended Part; spicePre: X; spiceSymbolName: SX1B32.000F1210F30